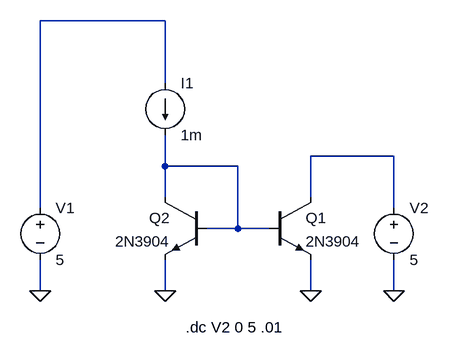
[diagram p0: schematic current_mirror.asc]
current_mirror.asc, the LTspice schematic file:
Version 4
SHEET 1 880 680
WIRE -16 -160 -208 -160
WIRE -16 -64 -16 -160
WIRE 336 48 208 48
WIRE -16 64 -16 16
WIRE 96 64 -16 64
WIRE -16 112 -16 64
WIRE 208 112 208 48
WIRE -208 128 -208 -160
WIRE 336 128 336 48
WIRE 96 160 96 64
WIRE 96 160 48 160
WIRE 144 160 96 160
WIRE -208 256 -208 208
WIRE -16 256 -16 208
WIRE 208 256 208 208
WIRE 336 256 336 208
FLAG 208 256 0
FLAG 336 256 0
FLAG -16 256 0
FLAG -208 256 0
SYMBOL voltage 336 112 R0
WINDOW 123 0 0 Left 0
WINDOW 39 0 0 Left 0
SYMATTR InstName V2
SYMATTR Value 5
SYMBOL npn3 144 112 R0
SYMATTR InstName Q1
SYMATTR Value 2N3904
SYMBOL npn3 48 112 M0
SYMATTR InstName Q2
SYMATTR Value 2N3904
SYMBOL current -16 -64 R0
WINDOW 123 0 0 Left 0
WINDOW 39 0 0 Left 0
SYMATTR InstName I1
SYMATTR Value 1m
SYMBOL voltage -208 112 R0
WINDOW 123 0 0 Left 0
WINDOW 39 0 0 Left 0
SYMATTR InstName V1
SYMATTR Value 5
TEXT 16 312 Left 2 !.dc V2 0 5 .01

The netlist it stands for:
* current_mirror.asc
V2 N002 0 5
Q1 N002 N003 0 0 2N3904
Q2 N003 N003 0 0 2N3904
I1 N001 N003 1m
V1 N001 0 5
.model NPN NPN
.model PNP PNP
.lib standard.bjt
.dc V2 0 5 .01
.backanno
.end